# EAGLE design ArduiNode (EAGLE 6.4)

## Sheet 1 of 2
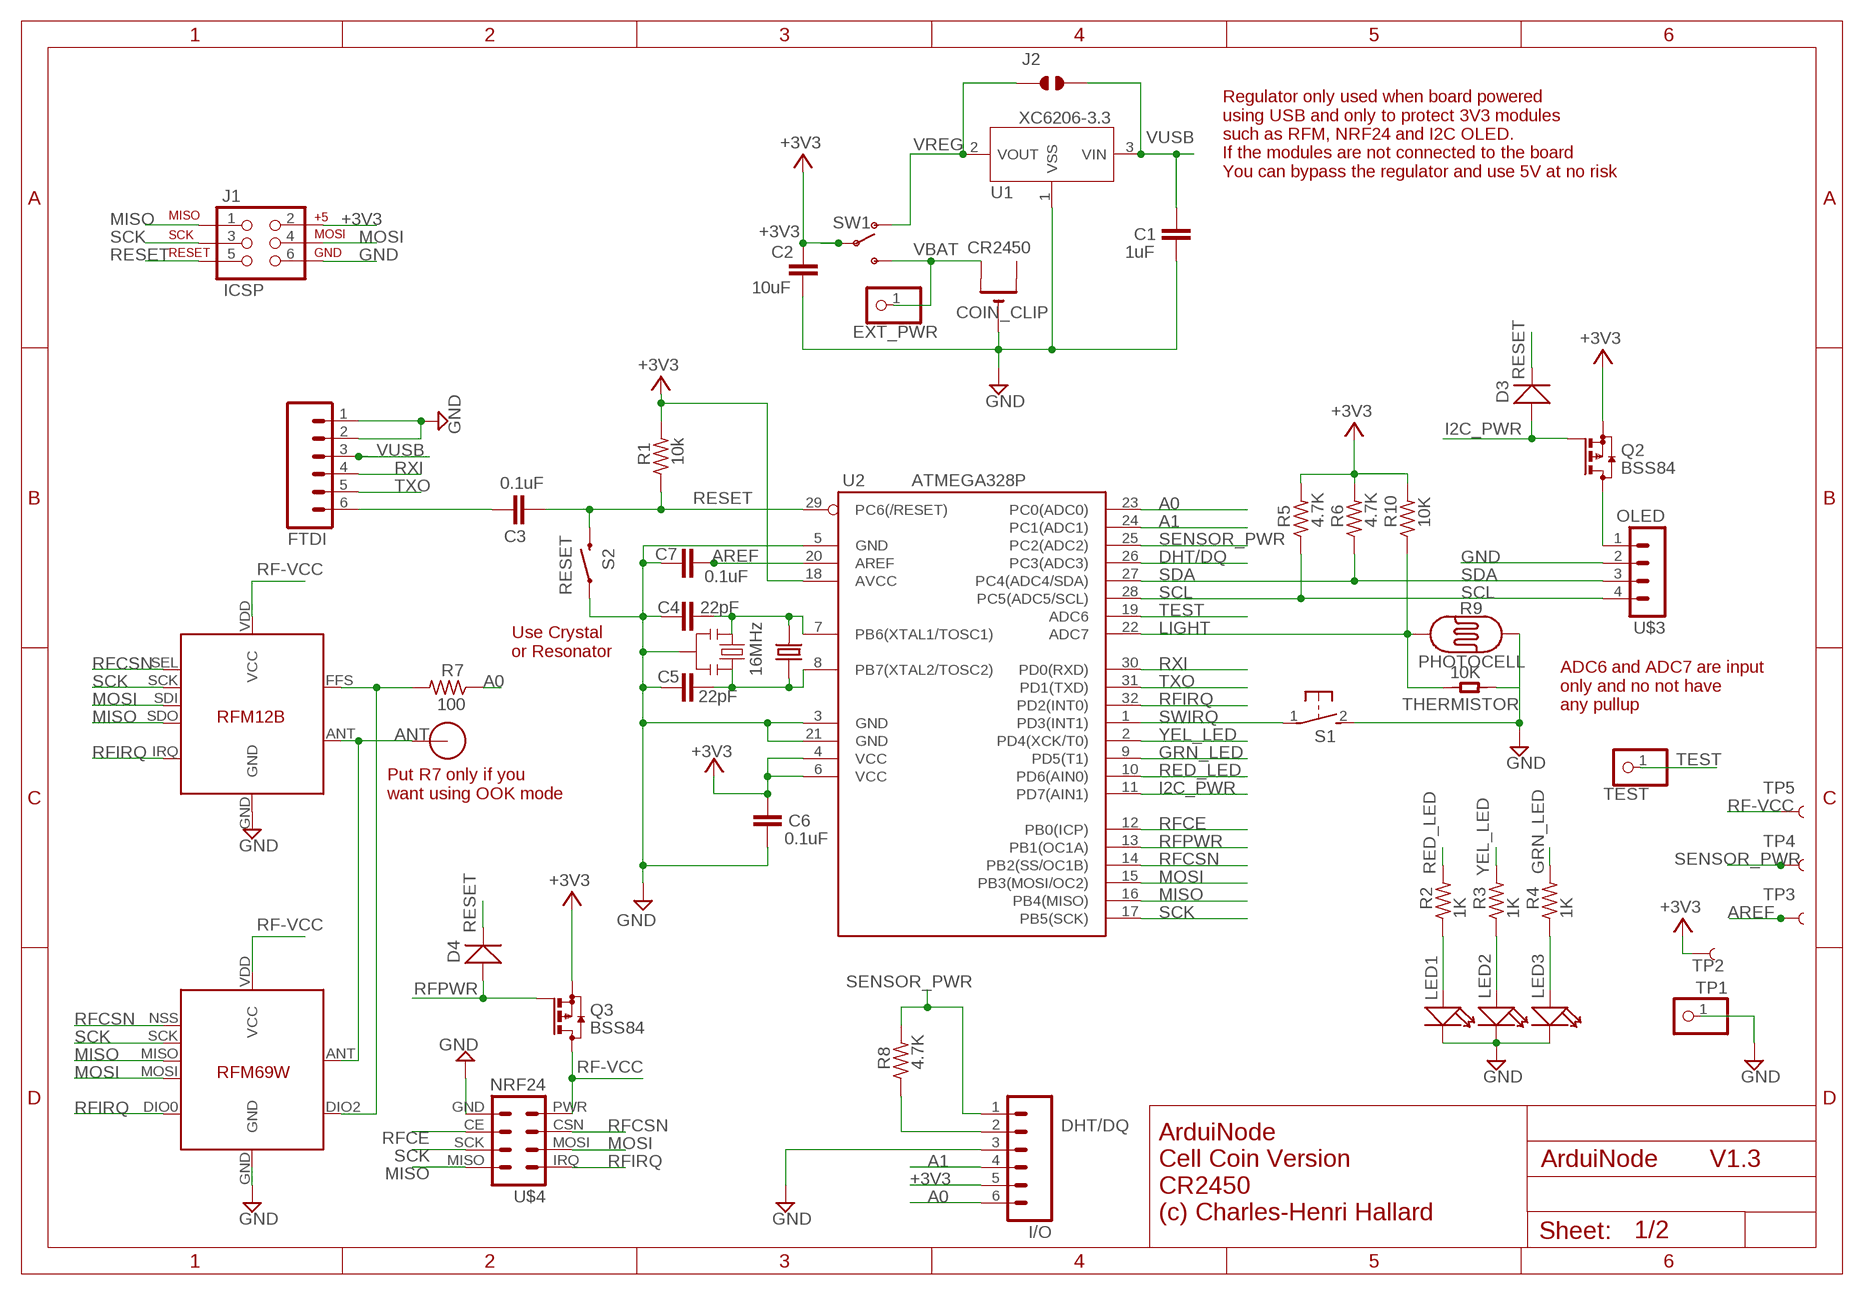
[diagram p0: schematic, sheet 1]

### Parts
C1  1uF  C-EUC0805K  [C0805K]
C2  10uF  C-EUC0805K  [C0805K]
C3  0.1uF  C-EUC0805K  [C0805K]
C4  22pF  C-EUC0805K  [C0805K]
C5  22pF  C-EUC0805K  [C0805K]
C6  0.1uF  C-EUC0805K  [C0805K]
C7  0.1uF  C-EUC0805K  [C0805K]
COIN_CLIP  CR2450  CR2450CR2450-THM  [CR1220-THM]
D3  D-SOD-123  [SOD123]
D4  D-SOD-123  [SOD123]
EXT_PWR  PINHD-1X1CB  [1X01-CLEANBIG]
FTDI  M06SIP_LOCK  [1X06-SIP_LOCK]
I/O  M06FEMALE_LOCK  [1X06_FEMALE_LOCK.010]
J1  ICSP  AVR_SPI_PRG_62X3_LOCK  [2X3_LOCK]
J2  JUMPER_SOLDER_1X2  [JUMPER_SOLDER_1X2]
LED1  LED0805  [LED-0805]
LED2  LED0805  [LED-0805]
LED3  LED0805  [LED-0805]
Q2  BSS84  [SOT23]
Q3  BSS84  [SOT23]
R1  10k  R-US_M0805  [M0805]
R2  1K  R-US_M0805  [M0805]
R3  1K  R-US_M0805  [M0805]
R4  1K  R-US_M0805  [M0805]
R5  4.7K  R-US_M0805  [M0805]
R6  4.7K  R-US_M0805  [M0805]
R7  100  R-US_M0805  [M0805]
R8  4.7K  R-US_M0805  [M0805]
R9  PHOTOCELL  PHOTOCELLPTH  [PHOTOCELL]
R10  10K  R-US_M0805  [M0805]
RFM12B  RFM12BNO  [RFM12B]
S1  DTS-3  [DTS-3]
S2  RESET  SWITCH-MOMENTARY-2-SMD-1101NE  [TACTILE-SWITCH-1101NE]
SW1  USB_COIN  SW_SPDT_SMD  [SWITCH-SPDT-SMD]
TEST  PINHD-1X1CB  [1X01-CLEANBIG]
THERMISTOR  10K  R-0603  [R0603]
TP1  PINHD-1X1  [1X01]
TP2  TEST-POINT3X5  [PAD.03X.05]
TP3  TEST-POINT3X5  [PAD.03X.05]
TP4  TEST-POINT3X5  [PAD.03X.05]
TP5  TEST-POINT3X5  [PAD.03X.05]
U1  XC6206-3.3  XC6206-3.3-1300260P1  [SOT23]
U2  ATMEGA328P  ATMEGA328P-AU-1030060P1  [TQFP32]
U$3  OLED  M04_LOCK  [1X04_LOCK]
U$4  NRF24  [2X04_LOCK]
U$11  RFM12B_ANTENNA  [RFM12B-ANTENNA]
X2  16MHz  CRYSTAL-0500290P1  [2P-SMD-5.0X3.2]
X3  RFM69  [RFM69W-MINPADS]
Y1  16MHz  RESONATOR16MHZ  [RESONATOR-SMD]

### Nets
+3V3 [power]: C2.1 C6.2 I/O.5 J1.2 Q2.2(S) Q3.2(S) R1.2 R5.2 R6.2 R10.2 SW1.2 TP2.P$1 U2.4(VCC) U2.6(VCC) U2.18(AVCC)
A0: I/O.6 R7.1 U2.23(PC0(ADC0))
A1: I/O.4 U2.24(PC1(ADC1))
ANT: RFM12B.ANT U$11.P$1 X3.ANT
AREF: C7.1 TP3.P$1 U2.20(AREF)
DHT/DQ: I/O.2 R8.1 U2.26(PC3(ADC3))
DTR: C3.1 FTDI.6
GND [GND]: C1.2 C2.2 C4.2 C5.2 C6.1 C7.2 COIN_CLIP.GND(-) FTDI.1 FTDI.2 I/O.3 J1.6 LED1.- LED2.- LED3.- R9.1 RFM12B.GND S1.2 S2.P$1 THERMISTOR.1 TP1.1 U1.1(VSS) U2.3(GND) U2.5(GND) U2.21(GND) U$3.2 U$4.GND X3.GND Y1.2
GRN_LED: R4.2 U2.9(PD5(T1))
I2C_PWR: D3.+ Q2.1(G) U2.11(PD7(AIN1))
LIGHT: R9.2 R10.1 THERMISTOR.2 U2.22(ADC7)
MISO: J1.1 RFM12B.SDO U2.16(PB4(MISO)) U$4.MISO X3.MISO
MOSI: J1.4 RFM12B.SDI U2.15(PB3(MOSI/OC2)) U$4.MOSI X3.MOSI
N$1: R7.2 RFM12B.FFS X3.DIO2
N$2: LED1.+ R2.1
N$3: LED2.+ R3.1
N$4: LED3.+ R4.1
N$6: Q2.3(D) U$3.1
RED_LED: R2.2 U2.10(PD6(AIN0))
RESET: C3.2 D3.- D4.- J1.5 R1.1 S2.P$2 U2.29(PC6(/RESET))
RF-VCC [power]: Q3.3(D) RFM12B.VDD(VCC) TP5.P$1 U$4.PWR(VCC) X3.VDD(VCC)
RFCE: U2.12(PB0(ICP)) U$4.CE
RFCSN: RFM12B.SEL U2.14(PB2(SS/OC1B)) U$4.CSN X3.NSS(SEL)
RFIRQ: RFM12B.IRQ U2.32(PD2(INT0)) U$4.IRQ X3.DIO0
RFPWR: D4.+ Q3.1(G) U2.13(PB1(OC1A))
RXI: FTDI.4 U2.30(PD0(RXD))
SCK: J1.3 RFM12B.SCK U2.17(PB5(SCK)) U$4.SCK(CLK) X3.SCK
SCL: R5.1 U2.28(PC5(ADC5/SCL)) U$3.4
SDA: R6.1 U2.27(PC4(ADC4/SDA)) U$3.3
SENSOR_PWR: I/O.1 R8.2 TP4.P$1 U2.25(PC2(ADC2))
SWIRQ: S1.1 U2.1(PD3(INT1))
TEST [GND]: TEST.1 U2.19(ADC6)
TXO: FTDI.5 U2.31(PD1(TXD))
VBAT [power]: COIN_CLIP.+1(+) EXT_PWR.1 SW1.1
VREG [power]: J2.1 SW1.3 U1.2(VOUT)
VUSB [power]: C1.1 FTDI.3 J2.2 U1.3(VIN)
X1: C5.1 U2.8(PB7(XTAL2/TOSC2)) X2.1 Y1.3
XTAL1: C4.1 U2.7(PB6(XTAL1/TOSC1)) X2.2 Y1.1
YEL_LED: R3.2 U2.2(PD4(XCK/T0))
Unconnected: COIN_CLIP.+2(+1)

### Notes on the sheet
- Regulator only used when board powered
  using USB and only to protect 3V3 modules
  such as RFM, NRF24 and I2C OLED.
  If the modules are not connected to the board
  You can bypass the regulator and use 5V at no risk
- Use Crystal
  or Resonator
- ADC6 and ADC7 are input
  only and no not have 
  any pullup
- Put R7 only if you
  want using OOK mode
- V1.3
- ArduiNode 
  Cell Coin Version
  CR2450
  (c) Charles-Henri Hallard

## Sheet 2 of 2
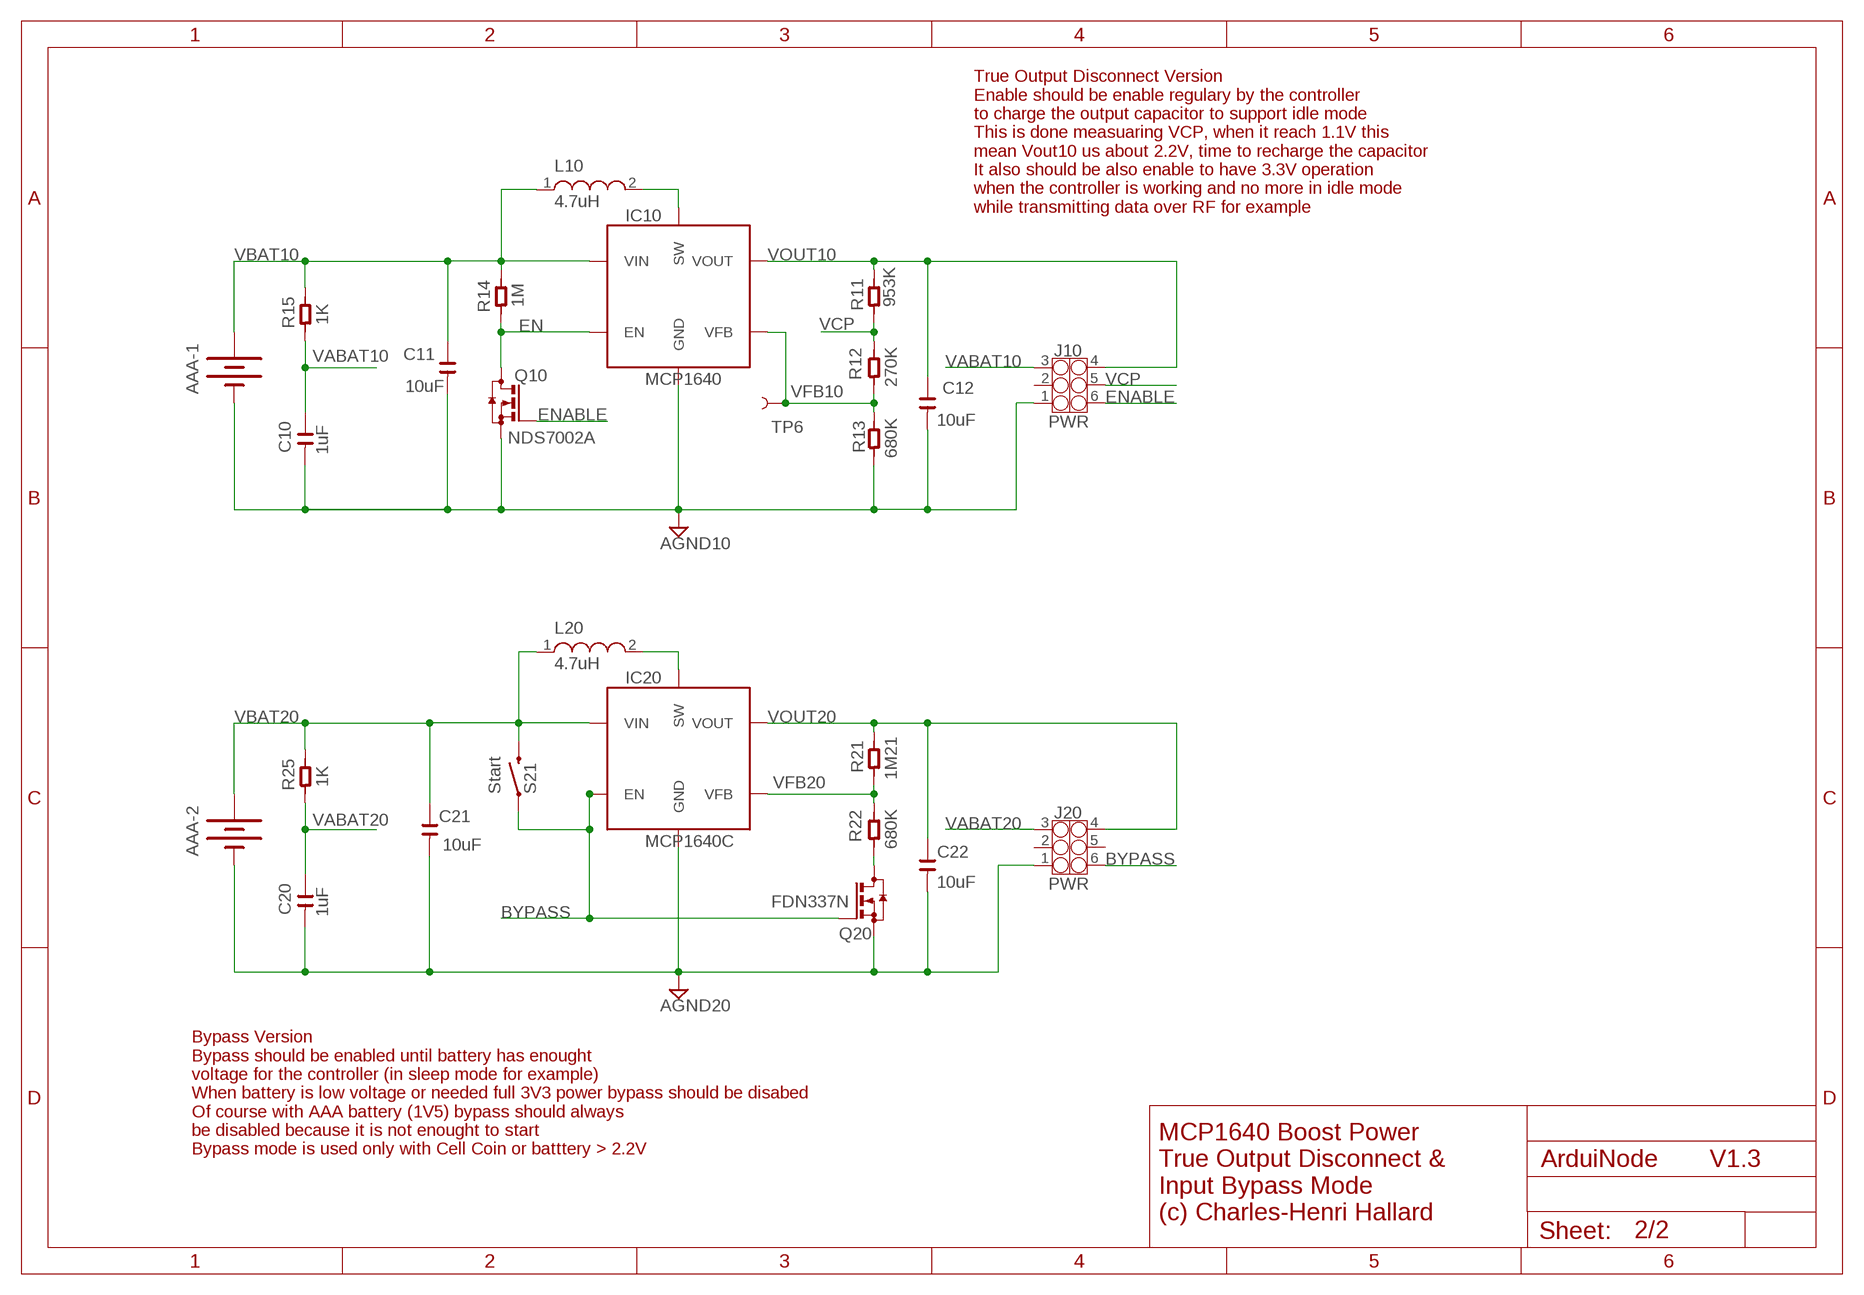
[diagram p1: schematic, sheet 2]

### Parts
AAA-1  BATTERYAAA-JL  [BATTERY-AAA-JL]
AAA-2  BATTERYAAA-JL  [BATTERY-AAA-JL]
C10  1uF  C-0805  [C0805]
C11  10uF  C-0805  [C0805]
C12  10uF  C-0805  [C0805]
C20  1uF  C-0805  [C0805]
C21  10uF  C-0805  [C0805]
C22  10uF  C-0805  [C0805]
IC10  MCP1640  [SOT23-6]
IC20  MCP1640C  MCP1640  [SOT23-6]
J10  PWR  CONNECTOR-HEADER-2X3P-3460180P1  [2X3P-2.54-2.54-11.6-3.0-BLACK-MALE]
J20  PWR  CONNECTOR-HEADER-2X3P-3460180P1  [2X3P-2.54-2.54-11.6-3.0-BLACK-MALE]
L10  4.7uH  INDUCTOR-L1812  [L1812]
L20  4.7uH  INDUCTOR-L1812  [L1812]
Q10  NDS7002A  BSS123  [SOT23]
Q20  FDN337N  BSS123  [SOT23]
R11  953K  R-0603  [R0603]
R12  270K  R-0603  [R0603]
R13  680K  R-0603  [R0603]
R14  1M  R-0603  [R0603]
R15  1K  R-0603  [R0603]
R21  1M21  R-0603  [R0603]
R22  680K  R-0603  [R0603]
R25  1K  R-0603  [R0603]
S21  Start  SWITCH-MOMENTARY-2-SMD-1101NE  [TACTILE-SWITCH-1101NE]
TP6  TEST-POINT3  [PAD.03X.03]

### Nets
AGND10 [GND]: AAA-1.GND@1(-) C10.1 C11.1 C12.1 IC10.2(GND) J10.1 Q10.2(S) R13.1
AGND20 [GND]: AAA-2.GND@1(-) C20.1 C21.1 C22.1 IC20.2(GND) J20.1 Q20.2(S)
BYPASS: IC20.3(EN) J20.6 Q20.1(G) S21.P$1
EN: IC10.3(EN) Q10.3(D) R14.1
ENABLE: J10.6 Q10.1(G)
N$5: Q20.3(D) R22.1
SW: IC10.1(SW) L10.2
SW20: IC20.1(SW) L20.2
VABAT10: C10.2 J10.3 R15.1
VABAT20: C20.2 J20.3 R25.1
VBAT10 [power]: AAA-1.PWR@1(+) C11.2 IC10.6(VIN) L10.1 R14.2 R15.2
VBAT20 [power]: AAA-2.PWR@1(+) C21.2 IC20.6(VIN) L20.1 R25.2 S21.P$2
VCP: J10.5 R11.1 R12.2
VFB10: IC10.4(VFB) R12.1 R13.2 TP6.P$1
VFB20: IC20.4(VFB) R21.1 R22.2
VOUT10: C12.2 IC10.5(VOUT) J10.4 R11.2
VOUT20: C22.2 IC20.5(VOUT) J20.4 R21.2
Unconnected: J10.2 J20.2 J20.5

### Notes on the sheet
- True Output Disconnect Version
  Enable should be enable regulary by the controller
  to charge the output capacitor to support idle mode
  This is done measuaring VCP, when it reach 1.1V this
  mean Vout10 us about 2.2V, time to recharge the capacitor
  It also should be also enable to have 3.3V operation
  when the controller is working and no more in idle mode 
  while transmitting data over RF for example
- Bypass Version
  Bypass should be enabled until battery has enought
  voltage for the controller (in sleep mode for example)
  When battery is low voltage or needed full 3V3 power bypass should be disabed
  Of course with AAA battery (1V5) bypass should always
  be disabled because it is not enought to start
  Bypass mode is used only with Cell Coin or batttery > 2.2V
- V1.3
- MCP1640 Boost Power
  True Output Disconnect &
  Input Bypass Mode
  (c) Charles-Henri Hallard

## Library data of the parts
AAA-1 AAA-2 = JeeLabs:BATTERY: Battery Holders Various common sizes : AA, AAA, 20mm coin cell and 12mm coin cell.
C1-C7 = resistor:C-EU: CAPACITOR, European symbol
C10-C12 C20-C22 = seeed-OPL:C*
COIN_CLIP = _c2h:CR2450
D3 D4 = seeed-OPL:D*: DIODE
EXT_PWR TEST TP1 = adafruit:PINHD-1X1: Pin header 1x1 for 0.1" spacing With round pins
FTDI I/O = JeeLabs.rpt:M06: Header 6 Standard 6-pin 0.1" header. Use with straight break away headers (SKU : PRT-00116), right angle break away headers (PRT-00553), swiss pins (PRT-00743), machine pins (PRT-00117), and female headers (PRT-00115). Molex polarized connector foot print use with SKU : PRT-08094 with associated crimp pins and housings. NOTES ON THE VARIANTS LOCK and LOCK_LONGPADS... This footprint was designed to help hold the alignment of a through-hole component (i.e. 6-pin header) while soldering it into place. You may notice that each hole has been shifted either up or down by 0.005 of an inch from it's more standard position (which is a perfectly straight line). This slight alteration caused the pins (the squares in the middle) to touch the edges of the holes. Because they are alternating, it causes a "brace" to hold the component in place. 0.005 has proven to be the perfect amount of "off-center" position when using our standard breakaway headers. Although looks a little odd when you look at the bare footprint, once you have a header in there, the alteration is very hard to notice. Also, if you push a header all the way into place, it is covered up entirely on the bottom side. This idea of altering the position of holes to aid alignment will be further integrated into the Sparkfun Library for other footprints. It can help hold any component with 3 or more connection pins.
IC10 IC20 = SteveMarple:MCP1640: MCP1640 0.65V Start-up Synchronous Boost Regulator with True Output Disconnect or Input/Output Bypass Option
J1 = SparkFun-Connectors:AVR_SPI_PRG_6: AVR ISP 6 Pin This is the reduced ISP connector for AVR programming. Common on Arduino. This footprint will take up less PCB space and can be used with a 10-pin to 6-pin adapter such as SKU: BOB-08508
J2 = dp_devices:JUMPER_SOLDER_1X2
J10 J20 = seeed-OPL:CONNECTOR-HEADER-2X3P
L10 L20 = dp_devices:INDUCTOR: Inductor
LED1-LED3 = Seeed-Discrete:LED*
Q2 Q3 = transistor-small-signal:BSS84: P-CHANNEL MOS FET
Q10 Q20 = transistor-small-signal:BSS123: N-CHANNEL MOS FET
R1-R8 R10 = resistor:R-US_: RESISTOR, American symbol
R9 = SparkFun-Sensors:PHOTOCELL: CdS photoresistor. This is a low cost way to detect light levels. Resistance decreases with more incoming light. SparkFun SKU: SEN-09088
R11-R15 R21 R22 R25 THERMISTOR = seeed-OPL:R*
RFM12B = JeeLabs.rpt:RFM12B
S1 = switch-tact:DTS-3
S2 S21 = SparkFun-Electromechanical:SWITCH-MOMENTARY-2: Various NO switches- pushbuttons, reed, etc
SW1 = _c2h:SW_SPDT_SMD
TP2-TP6 = SparkFun-Passives:TEST-POINT: Bare copper test points for troubleshooting or ICT
U1 = seeed-OPL:XC6206-3.3: LOW ESR Cap.Compatible Positive Voltage Regulators
U2 = seeed-OPL:ATMEGA328P-AU: 8-bit AVR Microcontroller with 32K Bytes In-System Programmable Flash
U$3 = _c2h:M04_LOCK
U$4 = _c2h:NRF24
U$11 = LowPowerLab:RFM12B_ANTENNA
X2 = seeed-OPL:CRYSTAL*
X3 = RFM69W:RFM69
Y1 = SparkFun-FreqCtrl:RESONATOR: Resonator Small SMD resonator. Used, eg, on the Arduino Pro/ Pro Mini boards. 8MHz- XTAL-08895 16MHz- XTAL-08900; PROD_ID: XTAL-08900

## Net classes
1 power: width 0.203 mm, drill 0.305 mm, clearance 0.152 mm
2 GND: width 0.203 mm, drill 0.305 mm, clearance 0.152 mm

## Board
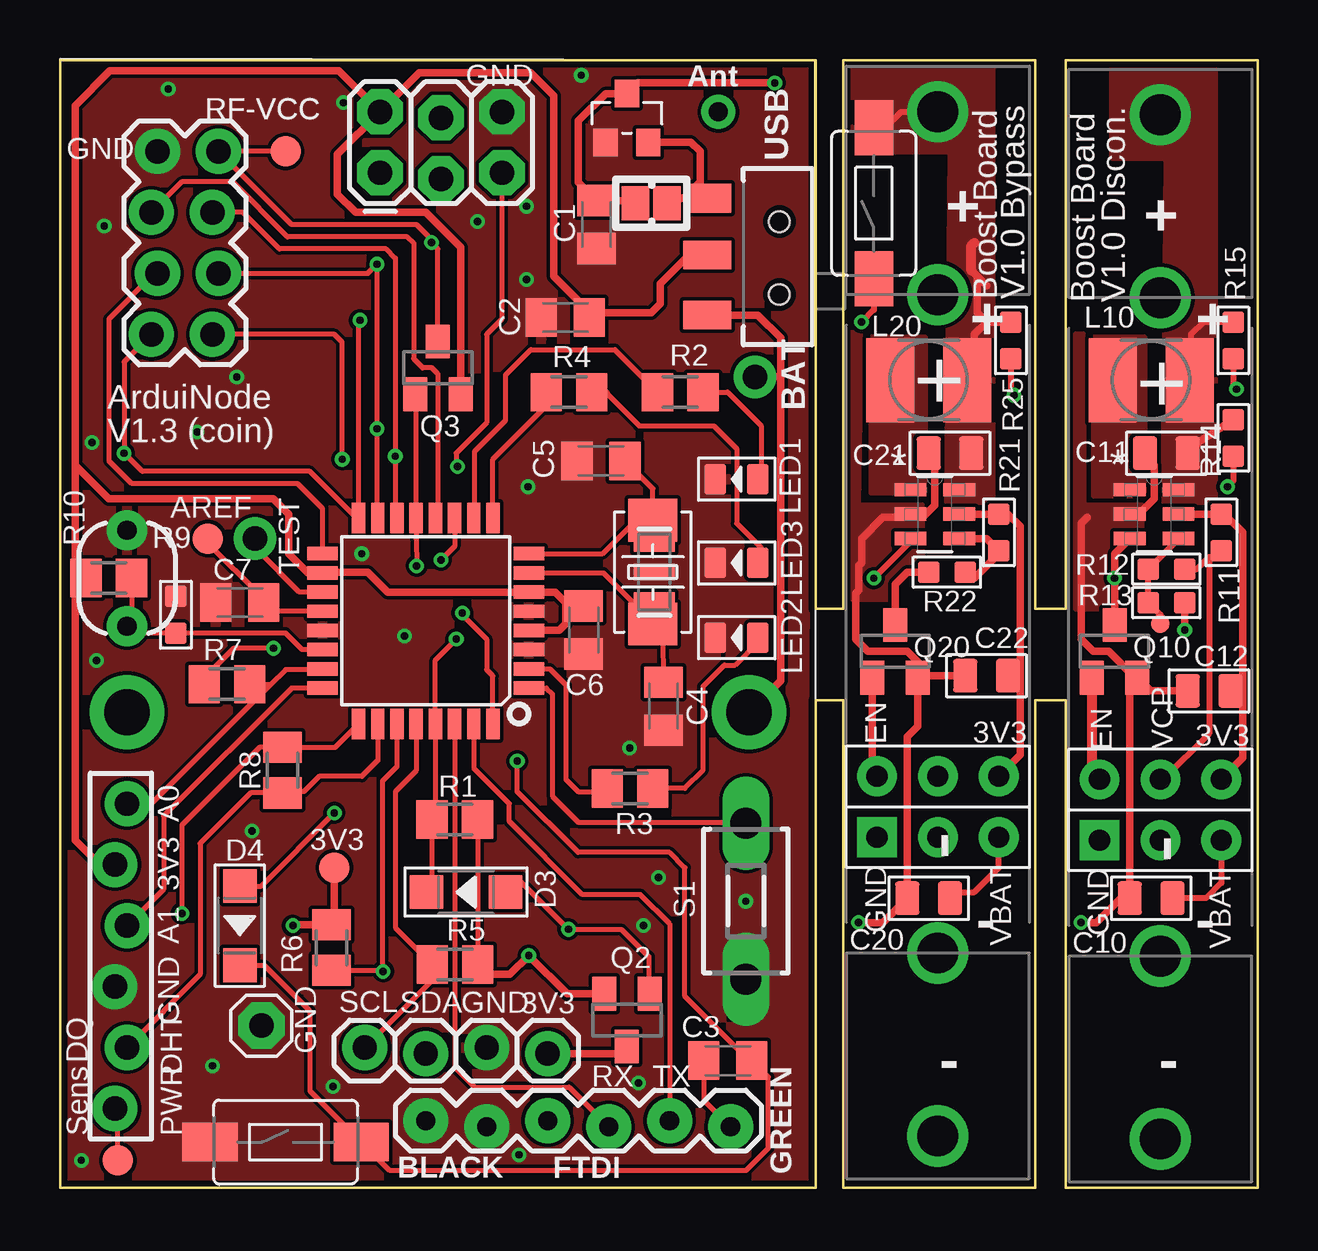
[diagram p2: board, top side]
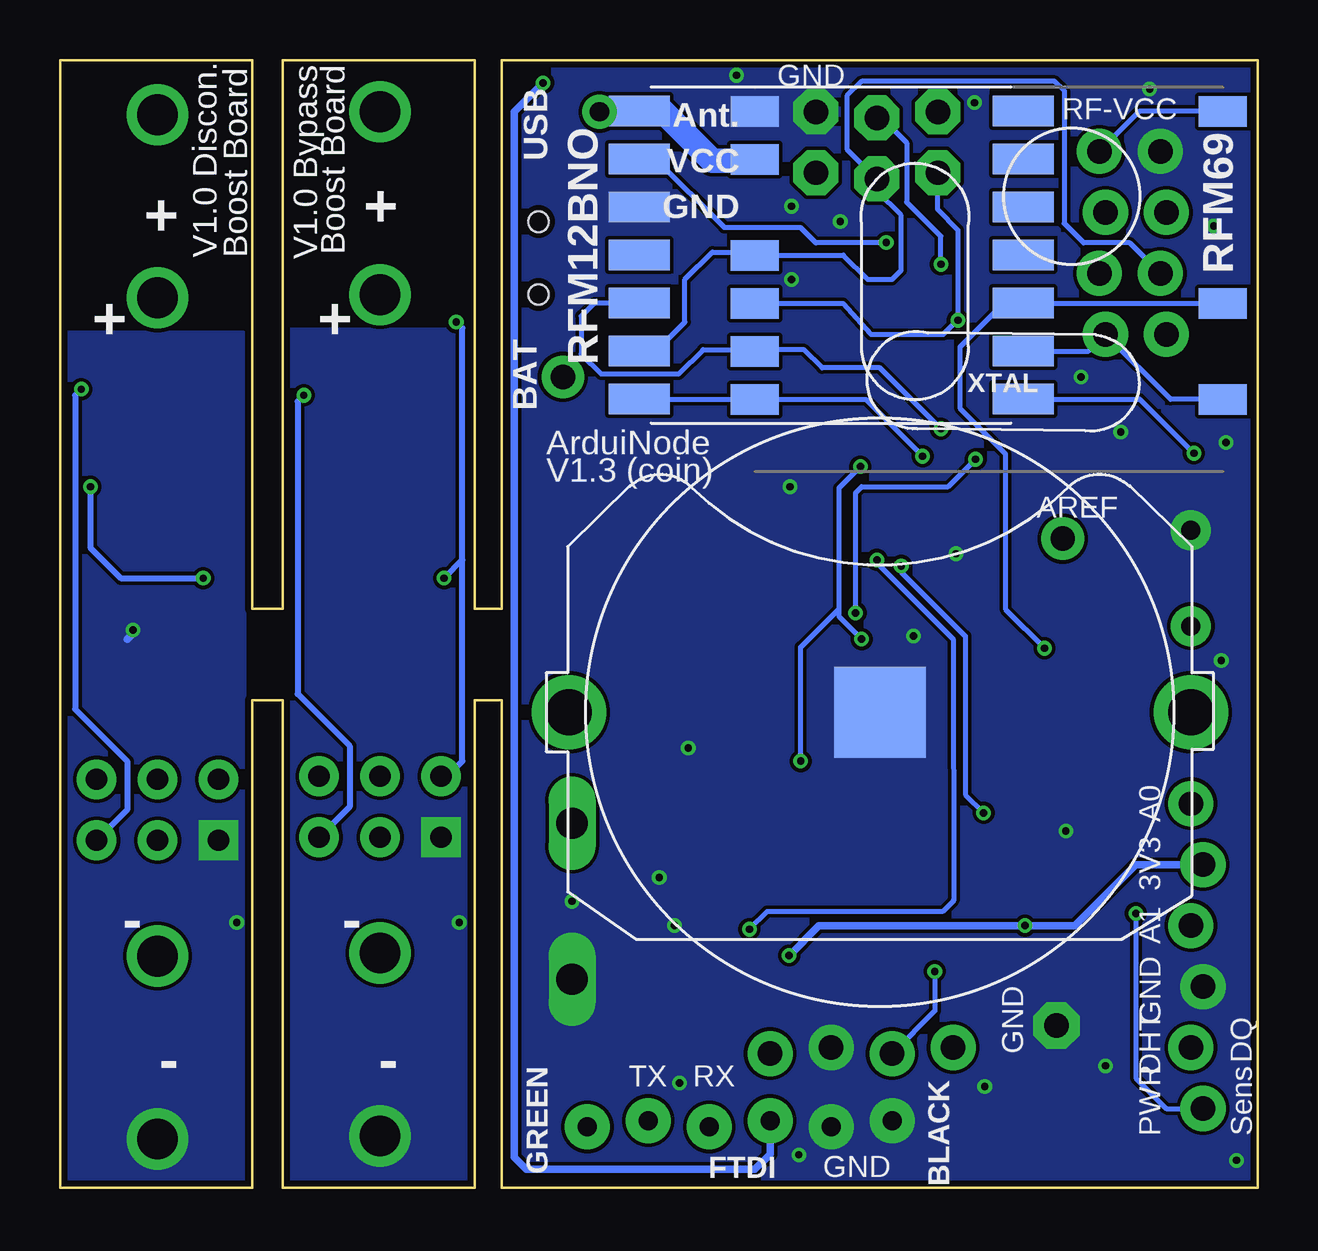
[diagram p3: board, bottom side, seen from below]

Size 49.91 x 46.99 mm. Coordinates in mm from the lower left corner, seen from the top.
Outline: 0,0 31.5,0 31.5,20.32 32.64,20.32 32.64,0 40.64,0 40.64,20.32 41.91,20.32 41.91,0 49.91,0 49.91,46.99 41.91,46.99 41.91,24.13 40.64,24.13 40.64,46.99 32.64,46.99 32.64,24.13 31.5,24.13 31.5,46.99 0,46.99 0,0
Copper layers (1*16): Top 0.035mm / dielectric 1.5mm / Bottom 0.035mm
Design rules "ITEADstudio_DRC *": minimum track width 6mil, minimum drill 12mil, track to track 6mil, track to pad 6mil, pad to pad 6mil, via to via 6mil, smd to smd 0mil, copper to edge 10mil, drill to drill 10mil, minimum pad ring 10mil, minimum via ring 6mil, stop-mask expansion 2mil, vias tented up to drill 100mil, thermal gap 0mil

### Footprints (pad centres in the part's own frame; a part is rotated, then mirrored left to right if it is on the bottom)
BATTERY-AAA-JL = drill 1.702: GND@1 21.082,0; GND@2 13.462,0; PWR@1 -21.59,0; PWR@2 -13.97,0
C0805K = smd 1.3 x 1.6: 1 -1,0; 2 1,0
C0805 = smd 1.016 x 1.397: 1 -0.889,0; 2 0.889,0
CR1220-THM = drill 1.9 pad 3.1: +1 -6.604,0; +2 19.304,0 | smd 3.81 x 3.81: GND 6.35,0
SOD123 = smd 1.397 x 1.397: + -1.651,0; - 1.651,0
1X01-CLEANBIG = drill 1.016 pad 1.778: 1 0,0
1X06-SIP_LOCK = drill 0.8 pad 1.88: 1 0,0; 2 2.54,-0.254; 3 5.08,0; 4 7.62,-0.254; 5 10.16,0; 6 12.7,-0.254
1X06_FEMALE_LOCK.010 = drill 1.016 pad 1.88: 1 0,0.254; 2 2.54,-0.254; 3 5.08,0.254; 4 7.62,-0.254; 5 10.16,0.254; 6 12.7,-0.254
SOT23-6 = smd 1.321 x 0.559: 1 -1.016,1.016; 2 -1.016,0; 3 -1.016,-1.016; 4 1.016,-1.016; 5 1.016,0; 6 1.016,1.016
2X3_LOCK = drill 1.016 pad 1.88 octagon: 1 0,0; 2 0,2.54; 3 2.54,-0.254; 4 2.54,2.286; 5 5.08,0; 6 5.08,2.54
JUMPER_SOLDER_1X2 = smd 1.143 x 1.422: 1 -0.66,0; 2 0.66,0
2X3P-2.54-2.54-11.6-3.0-BLACK-MALE = drill 0.889 pad 1.651 square: 1 -1.27,2.54 | drill 0.889 pad 1.651: 2 -1.27,0; 3 -1.27,-2.54; 4 1.27,-2.54; 5 1.27,0; 6 1.27,2.54
L1812 = smd 2 x 3.5: 1 -1.6,0; 2 1.6,0
LED-0805 = smd 0.889 x 1.27: + -0.889,0; - 0.889,0
SOT23 = smd 1 x 1.4: 1 -0.95,-1.1; 2 0.95,-1.1; 3 0,1.1
M0805 = smd 1.3 x 1.6: 1 -0.95,0; 2 0.95,0
PHOTOCELL = drill 0.8 pad 1.676: 1 -2,0; 2 2,0
R0603 = smd 0.889 x 0.889: 1 -0.762,0; 2 0.762,0
RFM12B = smd 2.54 x 1.27: ANT 8,-6; FFS -8,2; GND 8,-2; IRQ -8,4; P$8 -8,0; P$9 -8,-2; P$10 -8,-4; P$12 -8,-6; P$16 8,0; SCK 8,4; SDI 8,2; SDO -8,6; SEL 8,6; VDD 8,-4
DTS-3 = drill 1.3 long: 1 -3.25,0; 2 3.25,0
TACTILE-SWITCH-1101NE = smd 2.3 x 1.6: P$1 -3.15,0; P$2 3.15,0
SWITCH-SPDT-SMD = smd 1.2 x 2: 1 6.056,-1.353; 2 3.556,-1.353; 3 1.183,-1.353 | hole 0.85: 2.165,1.651; 5.201,1.651
1X01 = drill 1.016 pad 1.93 octagon: 1 0,0
PAD.03X.05 = smd 1.27 x 1.27: P$1 0,0
PAD.03X.03 = smd 0.762 x 0.762: P$1 0,0
SOT23' = smd 1.016 x 1.143: 1 -0.889,-1.016; 2 0.889,-1.016; 3 0,1.016
TQFP32 = smd 1.27 x 0.559: 1 -4.293,2.8; 2 -4.293,2; 3 -4.293,1.2; 4 -4.293,0.4; 5 -4.293,-0.4; 6 -4.293,-1.2; 7 -4.293,-2; 8 -4.293,-2.8; 17 4.293,-2.8; 18 4.293,-2; 19 4.293,-1.2; 20 4.293,-0.4; 21 4.293,0.4; 22 4.293,1.2; 23 4.293,2; 24 4.293,2.8 | smd 0.559 x 1.27: 9 -2.8,-4.293; 10 -2,-4.293; 11 -1.2,-4.293; 12 -0.4,-4.293; 13 0.4,-4.293; 14 1.2,-4.293; 15 2,-4.293; 16 2.8,-4.293; 25 2.8,4.293; 26 2,4.293; 27 1.2,4.293; 28 0.4,4.293; 29 -0.4,4.293; 30 -1.2,4.293; 31 -2,4.293; 32 -2.8,4.293
1X04_LOCK = drill 1.016 pad 1.88: 1 1.27,1.27; 2 3.81,1.016; 3 6.35,1.27; 4 8.89,1.016
2X04_LOCK = drill 1.016 pad 1.88: CE 6.35,1.27; CSN 6.35,-1.27; GND 8.89,1.016; IRQ 1.27,-1.27; MISO 1.27,1.27; MOSI 3.81,-1.524; PWR 8.89,-1.524; SCK 3.81,1.016
RFM12B-ANTENNA = drill 0.8 pad 1.422: P$1 0,0
2P-SMD-5.0X3.2 = smd 1.778 x 2.032: 1 -2.159,0; 2 2.159,0
RFM69W-MINPADS = smd 2 x 1.27: ANT 8,-5; DIO0 -11.5,5; DIO2 -11.5,1; GND 8,-7; MISO 8,1; MOSI 8,3; NSS 8,5; SCK 8,-1; VDD -11.5,-7
RESONATOR-SMD = smd 0.7 x 1.7: 1 -1.2,0; 2 0,0; 3 1.2,0

### Placement (x,y rotation side)
AAA-1  45.85,23.11 270 top
AAA-2  36.58,23.24 270 top
C1  22.35,40.13 270 top
C2  21.06,36.26 180 top
C3  27.83,5.3 0 top
C4  25.15,20.07 270 top
C5  22.54,30.29 180 top
C6  21.82,23.24 90 top
C7  7.49,24.38 180 top
C10  45.47,12.06 0 top
C11  46.1,30.61 0 top
C12  47.88,20.7 0 top
C20  36.2,12.06 0 top
C21  37.08,30.61 0 top
C22  38.61,21.34 0 top
COIN_CLIP  22.1,19.81 0 bottom
D3  16.92,12.32 180 top
D4  7.49,10.92 270 top
EXT_PWR  28.96,33.78 0 top
FTDI  15.24,2.79 0 top
I/O  2.54,3.3 90 top
IC10  45.59,28.07 0 top
IC20  36.45,28.07 0 top
J1  13.34,42.29 0 top
J2  24.64,41.02 180 top
J10  45.85,15.75 90 top
J20  36.58,15.88 90 top
L10  45.47,33.66 180 top
L20  36.2,33.66 180 top
LED1  28.19,29.53 180 top
LED2  28.19,22.92 180 top
LED3  28.19,26.04 180 top
Q2  23.62,6.99 180 top
Q3  15.75,34.16 0 top
Q10  43.94,22.35 0 top
Q20  34.8,22.35 0 top
R1  16.45,15.34 0 top
R2  25.84,33.15 180 top
R3  23.75,16.64 180 top
R4  21.21,33.15 180 top
R5  16.46,9.3 0 top
R6  11.32,10.01 90 top
R7  6.96,20.98 180 top
R8  9.27,17.4 90 top
R9  2.79,25.4 270 top
R10  2.03,25.4 180 top
R11  48.39,27.3 90 top
R12  46.1,25.78 0 top
R13  46.1,24.38 180 top
R14  48.9,31.24 90 top
R15  48.9,35.31 90 top
R21  39.12,27.3 90 top
R22  36.96,25.65 0 top
R25  39.62,35.31 90 top
RFM12B  17.78,38.86 180 bottom
S1  28.57,11.94 270 top
S2  9.4,1.91 0 top
S21  33.91,41.02 90 top
SW1  28.32,42.42 270 top
TEST  8.13,27.05 0 top
THERMISTOR  4.83,23.88 270 top
TP1  8.39,6.76 0 top
TP2  11.43,13.34 0 top
TP3  6.16,27.05 0 top
TP4  2.41,1.14 0 top
TP5  9.4,43.18 0 top
TP6  45.85,23.5 0 top
U1  XC6206-3.3  [SOT23']  23.62,44.58 0 top
U2  15.24,23.62 180 top
U$3  21.59,6.86 180 top
U$4  5.08,34.29 90 top
U$11  27.43,44.83 0 top
X2  24.7,25.65 270 top
X3  12.95,37.85 180 bottom
Y1  24.77,25.65 90 top

### Tracks (layer width: path | path; a pad name or v marks a point on that pad's centre or on a via)
+3V3  (via drill 0.3)
  Top 0.203: R1.2 17.4,9.31 17.82,8.89 | 21.08,24.38 21.8,24.38 C6.2
  Top 0.305: U2.4 20.81,23.22 21.08,23.5 21.08,24.38 20.64,24.82 U2.6 13.66,24.82 12.83,25.65 10.98,25.65 U2.18 10.32,25.62 9.53,26.42 9.53,28.07 8.89,28.7 2.03,28.7 0.64,30.1 | Q3.2 16.7,39.18 15.24,40.64 12.32,40.64 11.56,41.4 11.56,43.05 J1.2 | J1.2 14.96,46.46 19.61,46.46 20.57,45.49 20.57,37.97 22.1,36.45 | C2.1 22.06,36.41 22.1,36.45 | SW1.2 26.08,38.73 25.02,37.67 25.02,36.83 24.64,36.45 22.1,36.45 | R5.2 17.82,8.89 18.75,8.89 v19.53,9.68 21.12,8.09 Q2.2 | R6.2 9.74,10.96 v9.7,10.92 | 11.09,11.19 R6.2 | J1.2 12.45,45.72 12.42,45.72 11.61,46.53 2.08,46.53 0.64,45.09 0.64,30.1 | I/O.5 1.65,13.46 0.64,14.48 0.64,25.4 | 0.64,25.4 0.64,30.1 | TP2.P$1 11.43,11.07 R6.2 | R10.2 0.64,25.4
  Bottom 0.305: I/O.5 5.08,13.46 7.62,10.92 v9.7,10.92 18.29,10.92 v19.53,9.68
A0
  Top 0.203: 8.79,20.98 3.81,16 I/O.6 | U2.23 10.91,21.59 9.4,21.59 8.79,20.98 | R7.1 8.79,20.98
A1
  Top 0.203: U2.24 9.65,20.82 4.32,15.49 4.32,12.45 I/O.4
AGND10  (via drill 0.3)
  Top 0.305: IC10.2 44.96,28.07 45.59,28.7 45.59,30.1 45.21,30.48 C11.1 | R13.1 v46.86,23.24 | 42.8,27.94 42.55,27.69 42.55,22.86 43.05,22.35 43.69,22.35 44.79,21.25 Q10.2 | Q10.2 44.89,21.27 | Q10.2 44.58,20.94 44.58,12.32 C10.1 44.2,12.06 43.18,11.05 v42.55,11.05 | C12.1 45.44,20.7 Q10.2
  Bottom 0.305: v46.86,23.24 46.86,23.11 47.12,22.86
  pour Bottom: 42.29,35.56 42.29,0 49.66,0 49.66,35.56
  pour Top: 42.29,35.56 42.29,24.13 45.09,24.13 45.09,28.45 42.67,28.45 42.67,35.56
AGND20  (via drill 0.3)
  Top 0.305: C21.1 36.45,30.35 36.45,28.45 35.94,27.94 IC20.2 35.31,27.94 34.29,27.94 33.4,27.05 33.4,26.04 33.27,25.91 33.27,24.89 33.15,24.77 33.15,22.86 33.66,22.35 35.31,22.35 35.94,21.72 35.94,21.45 Q20.2 | Q20.2 35.75,21.65 | v33.27,11.05 34.29,11.05 C20.1 35.31,18.8 35.75,19.24 Q20.2 | C22.1 35.83,21.34 Q20.2
  pour Bottom: 33.02,35.69 33.02,0.13 40.51,0.13 40.51,35.69
  pour Top: 33.02,35.69 33.02,24.51 35.94,24.51 35.94,28.45 33.27,28.45 33.4,35.69
ANT
  Bottom 0.203: 22.02,42.8 20.95,42.8 X3.ANT
  Bottom 0.305: U$11.P$1 25.81,44.83 RFM12B.ANT
  Bottom 1.016: RFM12B.ANT 24.8,44.86 22.73,42.8 22.02,42.8
AREF
  Top 0.203: U2.20 8.89,24.02 | 8.89,24.02 8.67,24.02 C7.1 | 8.89,24.02 8.19,24.72 8.19,24.83 6.35,26.67 6.35,26.86 TP3.P$1
BYPASS  (via drill 0.3)
  Top 0.254: 35.43,26.92 v33.91,25.4 | S21.P$1 33.91,36.58 v33.4,36.07
  Top 0.305: Q20.1 33.85,17.33 J20.6 | IC20.3 35.43,26.92
  Bottom 0.254: 33.91,17.27 33.66,17.27 33.15,17.78 33.15,26.16 | 33.15,26.16 v33.91,25.4 | 33.15,26.16 33.15,35.81 v33.4,36.07
  Bottom 0.305: 33.91,17.27 J20.6
DHT/DQ
  Top 0.203: U2.26 13.24,17.81 12.57,17.14 10.79,17.14 10.16,16.51 9.33,16.51 R8.1 7.94,16.45 5.84,14.35 5.84,8.89 I/O.2
DTR
  Top 0.203: C3.1 26.83,3.65 FTDI.6
EN  (via drill 0.3)
  Top 0.254: IC10.3 45.09,27.05 | R14.1 48.9,29.46 v48.64,29.21
  Top 0.305: IC10.3 43.94,26.42 v43.94,25.4 Q10.3
  Bottom 0.254: v48.64,29.21 48.64,26.67 47.37,25.4 v43.94,25.4
ENABLE
  Top 0.406: Q10.1 42.99,17.33 J10.6
GND  (via drill 0.3)
  Top 0.305: 19.6,22.35 U2.3
  Bottom 0.203: 24.77,41.15 25.49,41.15 RFM12B.GND
  other vias: 24.31,10.92 23.74,18.33 19.43,37.85 28.57,11.94 14.35,22.99 12.57,26.42 17.4,40.26 5.71,31.5 19.49,29.21 6.35,5.08 24.1,4.37 19.13,1.37 11.38,4.22 0.89,1.14 24.94,12.93 4.51,45.78 21.72,46.35 19.43,40.89 7.37,33.78 1.33,31.05 1.84,40.07 8,14.86 11.81,45.21 1.52,21.97
  pour Top: -0.08,47.35 0,0 30.99,-0.38 31.09,46.94
  pour Bottom: -0.03,47.32 0,0 31.62,0 31.72,47.17
GRN_LED
  Top 0.203: U2.9 18.03,30.35 20.26,32.58 R4.2
I2C_PWR  (via drill 0.3)
  Top 0.203: U2.11 16.44,26.73 v15.88,26.16 | 19.05,12.9 19.15,12.8 | 19.15,12.8 v21.18,10.77 23.39,10.77 24.54,9.63 24.54,8.12 Q2.1 | D3.+ 18.67,12.32 19.15,12.8
  Bottom 0.203: v15.88,26.16 15.88,26.04 12.7,22.86 12.68,12.01 12.68,11.96 13.13,11.51 20.45,11.51 v21.18,10.77
LIGHT
  Top 0.203: U2.22 10.09,22.42 9.4,23.11 THERMISTOR.2 3.02,23.11 R9.2 2.98,23.59 R10.1 2.79,25.4
MISO  (via drill 0.3)
  Top 0.203: v12.5,36.14 12.44,36.09 U2.16 12.34,27.91 10.41,29.84 3.43,29.84 v2.67,30.61 2.67,34.42 U$4.MISO
  Bottom 0.203: X3.MISO 17.29,36.85 16.13,35.56 13.11,35.56 12.5,36.17 | 9.81,32.89 RFM12B.SDO 4.92,32.86 v2.67,30.61 | J1.1 13.34,40.74 12.5,39.9 12.5,36.17 | 12.5,36.17 v12.5,36.14
MOSI  (via drill 0.3)
  Top 0.203: U2.15 13.21,27.95 v13.21,31.62 v13.21,38.48 12.83,38.1 U$4.MOSI
  Bottom 0.203: RFM12B.SDI 27.65,36.86 28.19,36.32 28.19,34.73 27.37,33.91 24.13,33.91 23.11,34.92 20.95,34.92 | J1.4 15.67,44.58 14.63,43.54 14.63,41.07 13.21,39.65 v13.21,38.48 | v13.21,31.62 15.75,34.16 18.16,34.16 18.92,34.92 20.95,34.92 | 20.95,34.92 X3.MOSI
N$1  (via drill 0.3)
  Top 0.203: v8.89,22.48 7.24,22.48 6.35,21.59 6.35,21.19 R7.2
  Bottom 0.203: v8.89,22.48 10.52,24.11 10.52,30.58 12.42,32.49 12.42,35.03 10.59,36.86 RFM12B.FFS 1.47,36.86 X3.DIO2
N$2
  Top 0.203: R2.1 27.81,33.15 29.21,31.75 29.21,29.78 29.08,29.65 LED1.+
N$3
  Top 0.203: 29.21,22.86 28.89,23.18 LED2.+ 29.08,22.73 28.13,21.78 27.69,21.78 26.8,20.89 26.8,17.4 26.04,16.64 R3.1
N$4
  Top 0.203: R4.1 22.8,33.15 22.8,33.08 24.13,31.75 27.24,31.75 28.19,30.8 28.19,27.69 29.21,26.67 29.21,26.16 LED3.+
N$5
  Top 0.305: 35.01,23.45 Q20.3 34.8,25.15 35.31,25.65 R22.1
N$6
  Top 0.305: U$3.1 23.32,5.59 Q2.3
RED_LED
  Top 0.203: U2.10 17.27,27.95 17.27,30.68 18.57,31.98 18.57,33.87 19.62,34.92 23.12,34.92 R2.2
RESET  (via drill 0.3)
  Top 0.203: J1.5 18.41,36.2 17.78,35.56 17.78,31.88 16.51,30.61 16.51,30.1 v16.56,30.05 | v16.51,22.86 15.64,21.99 U2.29 15.64,15.48 R1.1 15.5,12.55 D3.- | v19.05,17.78 19.05,16.51 21.59,13.97 25.4,13.97 26.04,13.34 26.04,7.98 28.71,5.3 C3.2 29.51,4.61 29.51,1.65 28.57,0.71 13.74,0.71 S2.P$2 10.41,4.04 10.41,7.37 8.51,9.27 D4.-
  Bottom 0.203: v16.51,22.86 17.45,23.8 17.45,24.13 | 17.45,24.13 17.45,29.16 v16.56,30.05 | v19.05,17.78 19.05,22.53 17.45,24.13
RF-VCC  (via drill 0.3)
  Top 0.203: Q3.3 15.75,39.12 v15.48,39.38 15.48,39.51 14.86,40.13 9.65,40.13 U$4.PWR TP5.P$1
  Bottom 0.203: 26.73,42.86 RFM12B.VDD 25.08,42.86 22.24,40.02 19.06,40.02 18.41,39.37 15.49,39.37 v15.48,39.38 | X3.VDD 4.94,44.85 U$4.PWR
RFCE
  Top 0.203: 15.62,27.93 U2.12 15.75,28.02 15.75,33.91 15.49,34.16 15.11,34.16 14.73,34.54 14.73,39.37 14.48,39.62 9.47,39.62 7.19,41.91 5.08,41.91 U$4.CE
RFCSN  (via drill 0.3)
  Top 0.203: U2.14 13.97,27.98 v13.97,30.48 13.97,38.73 13.59,39.12 9.14,39.12 7.62,40.64 U$4.CSN 6.48,40.77
  Bottom 0.203: RFM12B.SEL 20.94,32.86 | v13.97,30.48 16.34,32.85 X3.NSS 20.94,32.86 | 20.72,32.86 20.94,32.86
RFIRQ  (via drill 0.3)
  Top 0.203: v16.76,23.95 16.76,23.88 17.78,22.86 17.78,21.59 18.04,21.33 U2.32 | v11.76,30.35 11.76,35.23 11.43,35.56 U$4.IRQ
  Bottom 0.203: v16.76,23.95 16.76,28.96 16.51,29.21 12.9,29.21 v11.76,30.35 | X3.DIO0 3.64,32.85 U$4.IRQ 7.05,34.86 RFM12B.IRQ
RFPWR  (via drill 0.3)
  Top 0.203: v14.86,25.91 14.84,27.03 U2.13 14.84,33.02 Q3.1 | D4.+ 8.38,12.57 v11.43,15.62
  Bottom 0.203: v14.86,25.91 14.86,25.65 12.19,22.99 12.19,16.38 v11.43,15.62
RXI
  Top 0.203: U2.30 16.44,5.02 17.27,4.19 21.21,4.19 FTDI.4
SCK
  Top 0.203: U2.17 10.95,28.3 9.91,29.34 3,29.34 2.03,30.3 2.03,36.2 3.94,38.1 U$4.SCK
  Bottom 0.203: RFM12B.SCK 25.08,34.86 23.88,36.07 23.88,37.85 22.73,38.99 20.32,38.99 20.32,38.86 | 20.32,38.86 20.95,38.86 X3.SCK | 20.32,38.86 17.27,38.86 16.26,37.85 15.24,37.85 14.86,38.23 14.86,40.51 15.88,41.53 J1.3 17.12,43.28 17.12,45.49 16.51,46.1 8.46,46.1 8.08,45.72 8.08,40.18 7.26,39.37 5.33,39.37 U$4.SCK
SCL
  Top 0.203: R5.1 15.56,9.61 | U2.28 14.84,17.38 13.97,16.51 13.97,10.84 R5.1 | R5.1 15.51,8.65 U$3.4
SDA  (via drill 0.3)
  Top 0.203: U2.27 14.04,17.55 13.44,16.94 13.44,9.04 | 13.44,9.04 v13.46,9.02 | 13.44,9.04 11.33,9.04 R6.1
  Bottom 0.203: v13.46,9.02 13.46,7.37 U$3.3
SENSOR_PWR  (via drill 0.3)
  Top 0.203: U2.25 11.46,18.35 R8.2 8.32,18.35 5.08,15.11 v5.08,11.43 | TP4.P$1 2.41,3.17 I/O.1
  Bottom 0.203: v5.08,11.43 5.08,4.57 3.81,3.3 I/O.1
SW
  pour Top: 43.05,35.43 43.05,28.83 45.21,28.83 45.21,35.43
SW20
  pour Top: 33.78,35.43 33.78,28.96 36.07,28.96 36.07,35.43
SWIRQ
  Top 0.203: U2.1 20.26,20.82 20.51,20.57 20.51,16.32 21.59,15.24 28.52,15.24 S1.1
TEST
  Top 0.203: U2.19 9.98,24.82 8.26,26.54 8.26,26.92 TEST.1
TXO
  Top 0.203: FTDI.5 25.4,11 24.18,12.22 21.77,12.22 18.72,15.27 18.72,16 17.24,17.48 U2.31
VABAT10  (via drill 0.3)
  Top 0.254: R15.1 48.9,33.4 v49.02,33.27 | 46.48,12.57 C10.2 47.75,12.06 48.39,12.7 J10.3
  Bottom 0.254: v49.02,33.27 49.28,33.02 49.28,19.94 47.12,17.78 47.12,15.75 J10.3
VABAT20  (via drill 0.3)
  Top 0.254: R25.1 39.62,33.15 v39.75,33.02 | 36.83,12.32 38.1,12.32 39.12,13.34 J20.3
  Top 0.305: C20.2 36.83,12.32
  Bottom 0.254: v39.75,33.02 40.01,32.77 40.01,20.57 37.85,18.41 37.85,15.88 J20.3
VBAT
  Top 0.305: 30.02,33.78 30.02,35.41 29.07,36.36 SW1.1 | 30.02,33.78 30.02,21.13 COIN_CLIP.+1 | EXT_PWR.1 30.02,33.78
VBAT10
  Top 0.254: R15.2 47.62,36.07 47.12,35.56 47.12,33.71 L10.1
  Top 0.305: R14.2 47.5,31.11 C11.2
  pour Top: 43.81,46.61 43.81,42.93 46.1,42.93 45.97,28.57 48.13,28.57 48.13,46.61
VBAT20
  Top 0.254: S21.P$2 34.01,44.17 34.29,44.45 34.67,44.45 35.05,44.83 AAA-2.PWR@1
  Top 0.305: R25.2 38.61,36.07 | 38.61,36.07 38.1,35.56 38.1,33.96 L20.1 | 38.61,37.59 38.23,37.97 | 38.23,37.97 38.23,36.45 38.61,36.07 | 37.97,38.23 38.23,37.97
  Top 0.406: 37.97,38.23 37.97,39.24 38.1,39.37
  pour Top: 33.02,46.61 33.02,43.18 37.08,43.18 36.96,28.57 38.86,28.57 38.86,46.61
VCP
  Top 0.254: 47.88,26.29 47.88,18.92 45.97,17.02 J10.5 | 47.88,26.29 47.37,25.78 R12.2 | 47.88,26.29 48.13,26.29 R11.1
VFB10
  Top 0.254: IC10.4 R12.1 R13.2 45.85,23.88 TP6.P$1
VFB20
  Top 0.305: R22.2 37.97,25.4 38.1,25.4 39.12,26.42 R21.1 38.61,27.05 IC20.4
VOUT10
  Top 0.305: 49.28,20.32 49.28,27.3 48.51,28.07 R11.2 IC10.5 | 49.28,20.32 49.28,17.91 J10.4 | C12.2 49.28,20.32
VOUT20
  Top 0.254: C22.2 40.01,21.34
  Top 0.305: IC20.5 R21.2 39.5,28.07 40.01,27.56 40.01,21.34 40.01,18.03 J20.4
VREG
  Top 0.305: U1.2 26.29,43.56 26.67,43.18 26.67,41.91 | 26.67,41.91 26.67,41.53 SW1.3 | J2.1 26.04,41.27 26.67,41.91
VUSB  (via drill 0.3)
  Top 0.305: 23.75,45.72 U1.3 | U1.3 22.73,45.59 21.59,44.45 21.59,41.89 C1.1 22.5,41.27 J2.2 | v29.78,46.04 24.07,46.04 U1.3
  Bottom 0.305: FTDI.3 20.32,1.4 20.95,0.76 30.48,0.76 30.99,1.27 30.99,44.83 v29.78,46.04
X1
  Top 0.203: 24.38,27.94 X2.1 | X2.1 24.7,29.13 C5.1 | Y1.3 24.77,27.75 X2.1 | U2.8 22.61,26.42 24.13,27.94 24.57,27.94 X2.1
XTAL1
  Top 0.203: U2.7 22.64,25.62 24.13,24.13 24.44,24.13 Y1.1 24.64,24.33 24.64,23.75 X2.2 25.13,23.07 C4.1
YEL_LED
  Top 0.203: U2.2 20.41,21.62 21.08,20.95 21.08,17.02 21.59,16.51 22.67,16.51 R3.2

### Text on the board
tNames: GND | Ant | RF-VCC | RF-VCC | GND | USB | + | + | Boost Board | + | V1.0 Bypass | Boost Board | V1.0 Discon. | + | ArduiNode | BAT | V1.3 (coin) | AREF | VCP | EN | EN | 3V3 | 3V3 | A0 | 3V3 | GND | VBAT | GND | VBAT | 3V3 | - | - | GND | A1 | SCL | SDA | GND | 3V3 | GND | - | - | Sens | DQ | DHT | RX | TX | PWR | FTDI | GREEN | BLACK
bNames: GND | Boost Board | V1.0 Bypass | Boost Board | V1.0 Discon. | RF-VCC | USB | + | + | + | + | BAT | ArduiNode | AREF | V1.3 (coin) | A0 | 3V3 | - | - | A1 | GND | GND | - | - | DQ | Sens | DHT | BLACK | RX | TX | PWR | GND | FTDI | GREEN